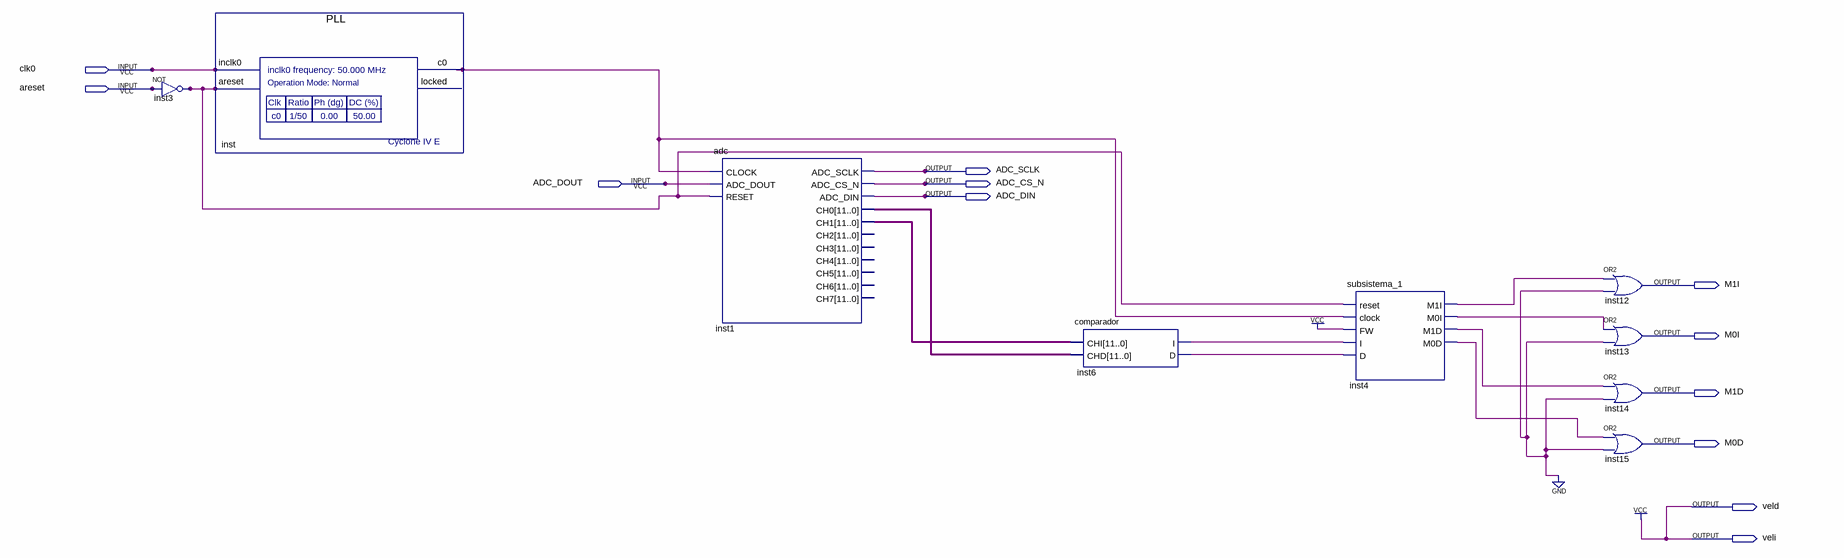
[diagram p0: schematic sheet]
// Quartus schematic Main_Esquematico.bdf as structural Verilog: 9 symbols, 12 pins
module Main_Esquematico (
  input  clk0,
  input  areset,
  input  ADC_DOUT,
  output ADC_SCLK,
  output ADC_CS_N,
  output ADC_DIN,
  output M1I,
  output M0I,
  output M1D,
  output M0D,
  output veld,
  output veli
);

  wire inst3_out, inst4_m0d, inst4_m0i, inst4_m1d, inst4_m1i, inst6_d, inst6_i, inst_c0;
  wire [11:0] inst1_ch0, inst1_ch1;

  not inst3 (inst3_out, areset);
  PLL inst (.inclk0(clk0), .areset(inst3_out), .c0(inst_c0));  // open: locked
  adc inst1 (
    .CLOCK(inst_c0), .ADC_DOUT(ADC_DOUT), .RESET(inst3_out), .ADC_SCLK(ADC_SCLK), .ADC_CS_N(ADC_CS_N),
    .ADC_DIN(ADC_DIN), .CH0(inst1_ch0), .CH1(inst1_ch1));  // open: CH2, CH3, CH4, CH5, CH6, CH7
  comparador inst6 (.CHI(inst1_ch1), .CHD(inst1_ch0), .I(inst6_i), .D(inst6_d));
  subsistema_1 inst4 (
    .reset(inst3_out), .clock(inst_c0), .FW(1'b1), .I(inst6_i), .D(inst6_d), .M1I(inst4_m1i),
    .M0I(inst4_m0i), .M1D(inst4_m1d), .M0D(inst4_m0d));
  or inst12 (M1I, inst4_m1i, 1'b0);
  or inst13 (M0I, inst4_m0i, 1'b0);
  or inst14 (M1D, inst4_m1d, 1'b0);
  or inst15 (M0D, inst4_m0d, 1'b0);

  assign veld = 1'b1;
  assign veli = 1'b1;
endmodule
